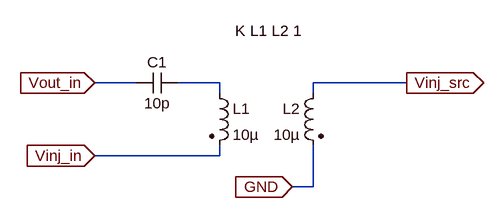
[diagram p0: schematic injector_insulator.asc]
injector_insulator.asc, the LTspice schematic file:
Version 4
SHEET 1 880 680
WIRE -48 64 -112 64
WIRE 80 64 16 64
WIRE 368 64 224 64
WIRE 80 80 80 64
WIRE 224 80 224 64
WIRE 80 176 80 160
WIRE 80 176 -112 176
WIRE 224 224 224 160
WIRE 224 224 192 224
FLAG 192 224 GND
IOPIN 192 224 In
FLAG -112 64 Vout_in
IOPIN -112 64 In
FLAG 368 64 Vinj_src
IOPIN 368 64 Out
FLAG -112 176 Vinj_in
IOPIN -112 176 In
SYMBOL ind2 64 64 R0
SYMATTR InstName L1
SYMATTR Value 10µ
SYMATTR Type ind
SYMBOL ind2 240 64 M0
SYMATTR InstName L2
SYMATTR Value 10µ
SYMATTR Type ind
SYMBOL cap 16 48 R90
WINDOW 0 0 32 VBottom 2
WINDOW 3 32 32 VTop 2
SYMATTR InstName C1
SYMATTR Value 10p
TEXT 104 -16 Left 2 !K L1 L2 1

The netlist it stands for:
* injector_insulator.asc
L1 N001 Vinj_in 10µ
L2 Vinj_src GND 10µ
C1 N001 Vout_in 10p
K L1 L2 1
.backanno
.end